# EAGLE design lcd1202 (EAGLE 5.10)
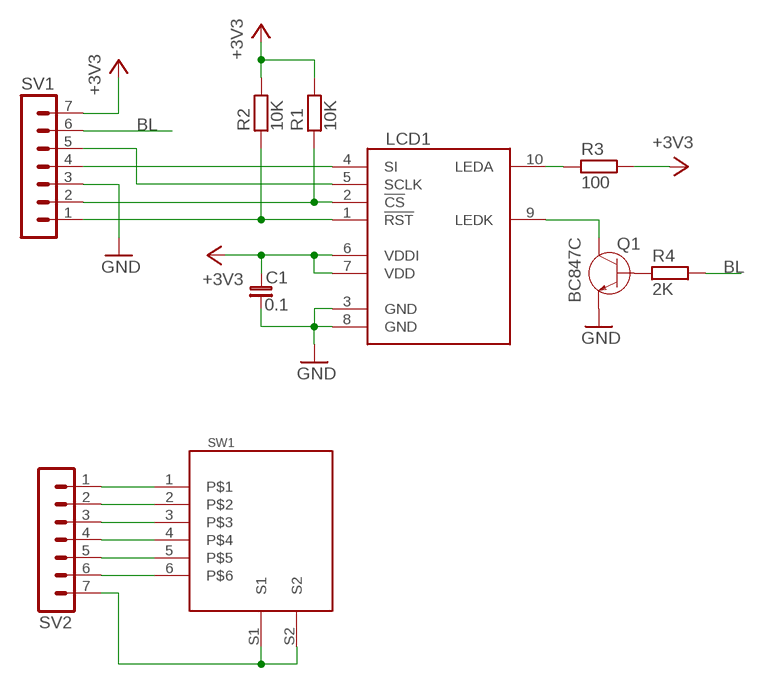
[diagram p0: schematic, sheet 1]

## Parts
C1  0.1  C_0603  [C0603]
LCD1  LCD1202-EXT  [NOKIA1202LCD-EXT]
Q1  BC847C  [SOT23]
R1  10K  R_0603  [R0603]
R2  10K  R_0603  [R0603]
R3  100  R_0603  [R0603]
R4  2K  R_0603  [R0603]
SV1  MA07-1  [MA07-1]
SV2  MA07-1  [MA07-1]
SW1  NOKIA-JOY  [NOKIA_JOY]

## Nets
+3V3: C1.1 LCD1.6(VDDI) LCD1.7(VDD) R1.2 R2.2 R3.2 SV1.7
BL: R4.2 SV1.6
GND: C1.2 LCD1.3(GND) LCD1.8(GND) Q1.2(E) SV1.3
N$3: LCD1.2(!CS) R1.1 SV1.2
N$4: LCD1.1(!RST) R2.1 SV1.1
N$5: LCD1.4(SI) SV1.4
N$6: LCD1.5(SCLK) SV1.5
N$7: LCD1.9(LEDK) Q1.3(C)
N$8: LCD1.10(LEDA) R3.1
N$9: Q1.1(B) R4.1
N$10: SV2.1 SW1.1
N$11: SV2.2 SW1.2
N$12: SV2.3 SW1.3
N$13: SV2.4 SW1.4
N$14: SV2.5 SW1.5
N$15: SV2.6 SW1.6
N$16: SV2.7 SW1.S1 SW1.S2

## Library data of the parts
C1 = rc-master-smd:C_: NON-POLARIZED CAP
LCD1 = lcd1202:LCD1202: 1.3" b/w graphics display 96x68 pixel. From Nokia 1202 cell phone
Q1 = semiconductor:BC847: Bipolar transistor NPN-structure
R1-R4 = rc-master-smd:R_: RESISTOR
SV1 SV2 = con-lstb:MA07-1: PIN HEADER
SW1 = buttons:NOKIA-JOY

## Board
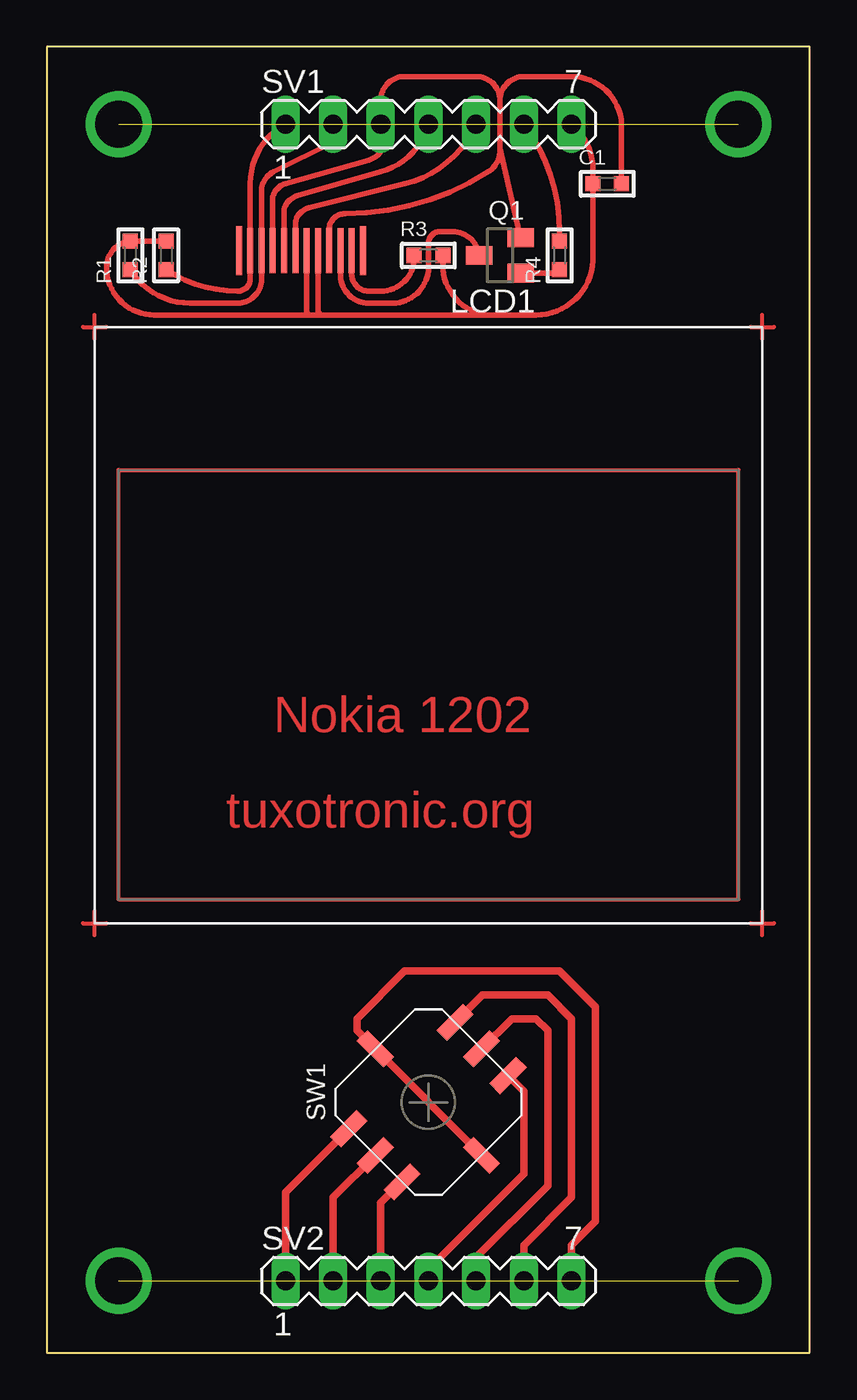
[diagram p1: board, top side]

Size 40.62 x 69.52 mm. Coordinates in mm from the lower left corner, seen from the top.
Outline: 0,0 40.62,0 40.62,69.52 0,69.52 0,0
Copper layers (1*16): Top 0.035mm / dielectric 1.5mm / Bottom 0.035mm
Design rules "default": minimum track width 10mil, minimum drill 24mil, track to track 8mil, track to pad 8mil, pad to pad 8mil, via to via 8mil, smd to smd 8mil, copper to edge 40mil, drill to drill 8mil, minimum pad ring 10mil, minimum via ring 8mil, stop-mask expansion 4mil, vias tented up to drill 0mil, thermal gap 10mil

### Footprints (pad centres in the part's own frame; a part is rotated, then mirrored left to right if it is on the bottom)
C0603 = smd 0.8 x 0.8: 1 -0.762,0; 2 0.762,0
NOKIA1202LCD-EXT = smd 0.32 x 2.6: 0 -10.09,23.114; 11 -3.49,23.114 | smd 0.32 x 2.4: 1 -9.49,23.114; 2 -8.89,23.114; 3 -8.29,23.114; 4 -7.69,23.114; 5 -7.09,23.114; 6 -6.49,23.114; 7 -5.89,23.114; 8 -5.29,23.114; 9 -4.69,23.114; 10 -4.09,23.114
SOT23 = smd 1 x 1.4: 1 -0.95,-1.1; 2 0.95,-1.1; 3 0,1.1
R0603 = smd 0.8 x 0.8: 1 -0.762,0; 2 0.762,0
MA07-1 = drill 1.016 long: 1 -7.62,0; 2 -5.08,0; 3 -2.54,0; 4 0,0; 5 2.54,0; 6 5.08,0; 7 7.62,0
NOKIA_JOY = smd 2 x 0.8 rotated 45: 1 -4.243,-1.414; 2 -2.828,-2.828; 3 -1.414,-4.243; 4 4.243,1.414; 5 2.828,2.828; 6 1.414,4.243 | smd 2 x 0.8 rotated 135: S1 -2.828,2.828; S2 2.828,-2.828

### Placement (x,y rotation side)
C1  29.84,62.23 0 top
LCD1  20.32,35.56 0 top
Q1  24.13,58.42 90 top
R1  4.45,58.42 90 top
R2  6.35,58.42 90 top
R3  20.32,58.42 0 top
R4  27.3,58.42 90 top
SV1  20.32,65.41 0 top
SV2  20.32,3.81 0 top
SW1  20.32,13.34 0 top

### Tracks (layer width: path | path; a pad name or v marks a point on that pad's centre or on a via)
+3V3
  Top 0.305: 13.97,55.24 5.71,55.24 arc-90 3.17,57.78 arc-85 R1.2 R2.2 | 13.97,55.24 14.61,55.24 | LCD1.7 14.43,55.42 14.61,55.24 | LCD1.6 13.83,55.38 13.97,55.24 | R3.2 21.08,57.91 arc84 23.5,55.24 | 14.61,55.24 23.5,55.24 | 23.5,55.24 26.04,55.24 arc92 29.08,58.42 C1.1 29.08,62.99 arc51 SV1.7
BL
  Top 0.305: R4.2 27.3,59.69 arc37 SV1.6
GND
  Top 0.305: LCD1.3 12.03,61.56 arc-58 12.7,62.23 17.14,63.5 arc111 SV1.3 17.78,66.67 arc-90 19.05,67.94 22.86,67.94 arc-90 24.13,66.67 | 24.13,66.67 24.13,64.14 | LCD1.8 15.03,59.8 arc-90 15.88,60.64 arc33 23.5,62.87 arc62 24.13,64.14 | C1.2 30.61,65.41 arc87 27.94,67.94 25.4,67.94 arc90 24.13,66.67 | 24.13,64.14 Q1.2
N$1  (via drill 2.5)  (1 unrouted)
  other vias: 3.81,3.81 36.83,3.81
N$2  (via drill 2.5)  (1 unrouted)
  other vias: 3.81,65.41 36.83,65.41
N$3
  Top 0.305: SV1.2 15.24,64.45 12.06,62.87 arc59 11.43,61.91 LCD1.2 11.43,57.15 arc-90 10.16,55.88 7.62,55.88 arc-58 R1.1
N$4
  Top 0.305: SV1.1 arc62 10.83,62.27 LCD1.1 10.83,57.19 arc-90 10.16,56.52 arc-33 R2.1
N$5
  Top 0.305: LCD1.4 12.63,60.89 arc-58 13.34,61.59 17.78,62.87 arc58 SV1.4
N$6
  Top 0.305: LCD1.5 13.23,60.22 arc-62 13.97,60.96 19.05,62.23 arc52 SV1.5
N$7
  Top 0.305: LCD1.9 15.63,57.47 arc93 17.14,55.88 18.41,55.88 arc90 20.32,57.78 20.32,59.05 arc-90 20.95,59.69 21.59,59.69 arc-83 Q1.3
N$8
  Top 0.305: LCD1.10 16.23,57.47 arc92 17.14,56.52 17.78,56.52 arc94 R3.1
N$9
  Top 0.305: Q1.1 27.12,57.47 R4.1
N$10
  Top 0.406: SW1.1 12.7,8.54 SV2.1
N$11
  Top 0.406: SW1.2 15.24,8.26 SV2.2
N$12
  Top 0.406: SW1.3 17.78,7.97 SV2.3
N$13
  Top 0.406: SV2.4 20.32,4.45 25.4,9.53 25.4,13.91 SW1.4
N$14
  Top 0.406: SW1.5 24.77,17.78 26.04,17.78 26.67,17.14 26.67,8.89 22.86,5.08 SV2.5
N$15
  Top 0.406: SW1.6 23.21,19.05 26.67,19.05 27.94,17.78 27.94,8.26 25.4,5.71 SV2.6
N$16
  Top 0.406: SW1.S2 SW1.S1 16.51,17.14 16.51,17.78 19.05,20.32 27.3,20.32 29.21,18.41 29.21,6.99 27.94,5.71 SV2.7
N$17
  Top 0.2: 1.91,22.86 3.17,22.86
N$18
  Top 0.2: 2.54,22.23 2.54,23.5
N$19
  Top 0.2: 37.47,22.86 38.73,22.86
N$20
  Top 0.2: 38.1,22.23 38.1,23.5
N$21
  Top 0.2: 37.47,54.61 38.73,54.61
N$22
  Top 0.2: 38.1,53.98 38.1,55.24
N$23
  Top 0.2: 2.54,53.98 2.54,55.24
N$24
  Top 0.2: 1.91,54.61 3.17,54.61
N$25
  Top 0.2: 36.83,24.13 36.83,46.99 3.81,46.99 3.81,24.13 36.83,24.13

### Text on the board
Top: Nokia 1202 | tuxotronic.org